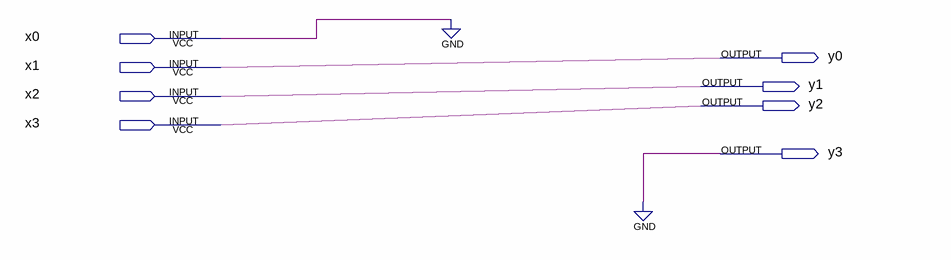
[diagram p0: schematic sheet]
// Quartus schematic divisor.bdf as structural Verilog: 0 symbols, 8 pins
module divisor (
  input  x0,
  input  x1,
  input  x2,
  input  x3,
  output y0,
  output y1,
  output y2,
  output y3
);


  assign y0 = x1;
  assign y1 = x2;
  assign y2 = x3;
  assign y3 = 1'b0;
  // also tied to GND on the sheet: x0
endmodule
